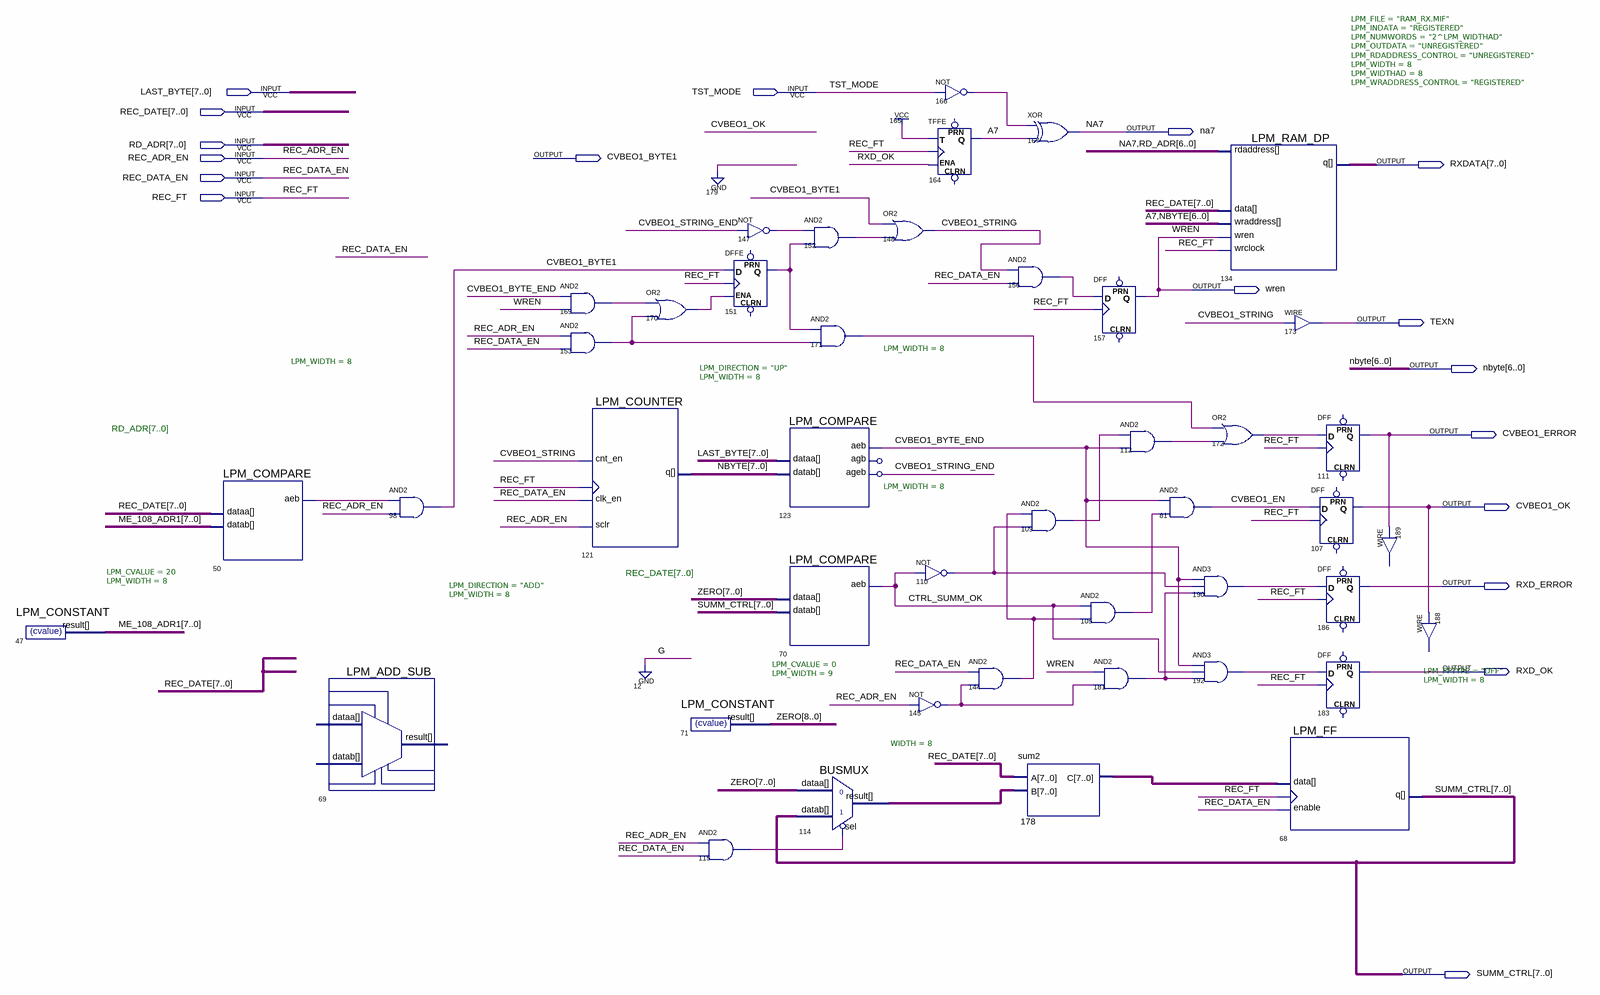
[diagram p0: schematic sheet]
// Quartus schematic me_108_rec_string.bdf as structural Verilog: 44 symbols, 18 pins
module me_108_rec_string (
  input  [7:0] LAST_BYTE,
  input  TST_MODE,
  input  [7:0] REC_DATE,
  input  [7:0] RD_ADR,
  input  REC_ADR_EN,
  input  REC_DATA_EN,
  input  REC_FT,
  output na7,
  output CVBEO1_BYTE1,
  output [7:0] RXDATA,
  output wren,
  output TEXN,
  output [7:0] nbyte,
  output CVBEO1_ERROR,
  output CVBEO1_OK,
  output RXD_ERROR,
  output RXD_OK,
  output [7:0] SUMM_CTRL
);

  wire A7, CTRL_SUMM_OK, CVBEO1_BYTE_END, CVBEO1_EN, CVBEO1_STRING, CVBEO1_STRING_END, n50_aeb, n105_out,
       n109_out, n110_out, n112_out, n115_out, n123_ageb, n144_out, n145_out, n147_out, n151_q, n152_out,
       n153_out, n156_out, n166_out, n169_out, n170_out, n171_out, n172_out, n181_out, n190_out, n192_out;
  wire [7:0] ME_108_ADR1, n114_result, n178_c;
  wire [8:0] ZERO;

  LPM_CONSTANT #(.LPM_CVALUE(20), .LPM_WIDTH(8)) u_47 (.result(ME_108_ADR1));
  LPM_COMPARE #(.LPM_WIDTH(8)) u_50 (.dataa(REC_DATE), .datab(ME_108_ADR1), .aeb(n50_aeb));
  LPM_ADD_SUB #(.LPM_DIRECTION("ADD"), .LPM_WIDTH(8)) u_69 ();  // open: datab, dataa, result
  and u_98 (CVBEO1_BYTE1, n50_aeb, REC_ADR_EN);
  and u_169 (n169_out, CVBEO1_BYTE_END, wren);
  and u_153 (n153_out, REC_ADR_EN, REC_DATA_EN);
  LPM_COUNTER #(.LPM_DIRECTION("UP"), .LPM_WIDTH(8)) u_121 (
    .cnt_en(CVBEO1_STRING), .clock(REC_FT), .clk_en(REC_DATA_EN), .sclr(REC_ADR_EN), .q(nbyte));
  or u_170 (n170_out, n169_out, n153_out);
  LPM_CONSTANT #(.LPM_CVALUE(0), .LPM_WIDTH(9)) u_71 (.result(ZERO));
  and u_115 (n115_out, REC_ADR_EN, REC_DATA_EN);
  not u_147 (n147_out, CVBEO1_STRING_END);
  DFFE u_151 (.D(CVBEO1_BYTE1), .CLK(REC_FT), .ENA(n170_out), .Q(n151_q));  // open: PRN, CLRN
  and u_152 (n152_out, n147_out, n151_q);
  and u_171 (n171_out, n151_q, n153_out);
  LPM_COMPARE #(.LPM_WIDTH(8)) u_123 (
    .dataa(LAST_BYTE), .datab(nbyte), .aeb(CVBEO1_BYTE_END), .ageb(n123_ageb));  // open: agb
  not u_123_ageb_inverted (CVBEO1_STRING_END, n123_ageb);
  LPM_COMPARE #(.LPM_WIDTH(8)) u_70 (.dataa(ZERO[7:0]), .datab(SUMM_CTRL), .aeb(CTRL_SUMM_OK));
  BUSMUX #(.WIDTH(8)) u_114 (.datab(SUMM_CTRL), .sel(~n115_out), .dataa(ZERO[7:0]), .result(n114_result));
  or u_148 (CVBEO1_STRING, CVBEO1_BYTE1, n152_out);
  not u_110 (n110_out, CTRL_SUMM_OK);
  not u_145 (n145_out, REC_ADR_EN);
  not u_166 (n166_out, TST_MODE);
  TFFE u_164 (.T(1'b1), .CLK(REC_FT), .ENA(RXD_OK), .Q(A7));  // open: CLRN, PRN
  and u_144 (n144_out, REC_DATA_EN, n145_out);
  and u_156 (n156_out, CVBEO1_STRING, REC_DATA_EN);
  and u_109 (n109_out, n144_out, n110_out);
  sum2 u_178 (.A(REC_DATE), .B(n114_result), .C(n178_c));
  xor u_167 (na7, n166_out, A7);
  DFF u_157 (.CLK(REC_FT), .D(n156_out), .Q(wren));  // open: CLRN, PRN
  and u_112 (n112_out, n109_out, CVBEO1_BYTE_END);
  and u_105 (n105_out, CTRL_SUMM_OK, n144_out);
  and u_181 (n181_out, wren, n145_out);
  and u_81 (CVBEO1_EN, CVBEO1_BYTE_END, n105_out);
  LPM_RAM_DP #(.LPM_FILE("RAM_RX.MIF"), .LPM_INDATA("REGISTERED"), .LPM_NUMWORDS("2^LPM_WIDTHAD"), .LPM_OUTDATA("UNREGISTERED"), .LPM_RDADDRESS_CONTROL("UNREGISTERED"), .LPM_WIDTH(8), .LPM_WIDTHAD(8), .LPM_WRADDRESS_CONTROL("REGISTERED")) u_134 (
    .wren(wren), .wrclock(REC_FT), .rdaddress({na7, RD_ADR[6:0]}), .data(REC_DATE),
    .wraddress({A7, nbyte[6:0]}), .q(RXDATA));
  or u_172 (n172_out, n171_out, n112_out);
  and u_190 (n190_out, CVBEO1_BYTE_END, n110_out, n181_out);
  and u_192 (n192_out, CVBEO1_BYTE_END, CTRL_SUMM_OK, n181_out);
  assign TEXN = CVBEO1_STRING;  // WIRE 173
  LPM_FF #(.LPM_FFTYPE("DFF"), .LPM_WIDTH(8)) u_68 (.enable(REC_DATA_EN), .clock(REC_FT), .data(n178_c), .q(SUMM_CTRL));
  DFF u_111 (.CLK(REC_FT), .D(n172_out), .Q(CVBEO1_ERROR));  // open: CLRN, PRN
  DFF u_107 (.CLK(REC_FT), .D(CVBEO1_EN), .Q(CVBEO1_OK));  // open: CLRN, PRN
  DFF u_186 (.CLK(REC_FT), .D(n190_out), .Q(RXD_ERROR));  // open: CLRN, PRN
  DFF u_183 (.CLK(REC_FT), .D(n192_out), .Q(RXD_OK));  // open: CLRN, PRN
  // WIRE 189 has open pins
  // WIRE 188 has open pins

  // Notes on the sheet:
  //   RD_ADR[7..0]
  //   REC_DATE[7..0]
endmodule
